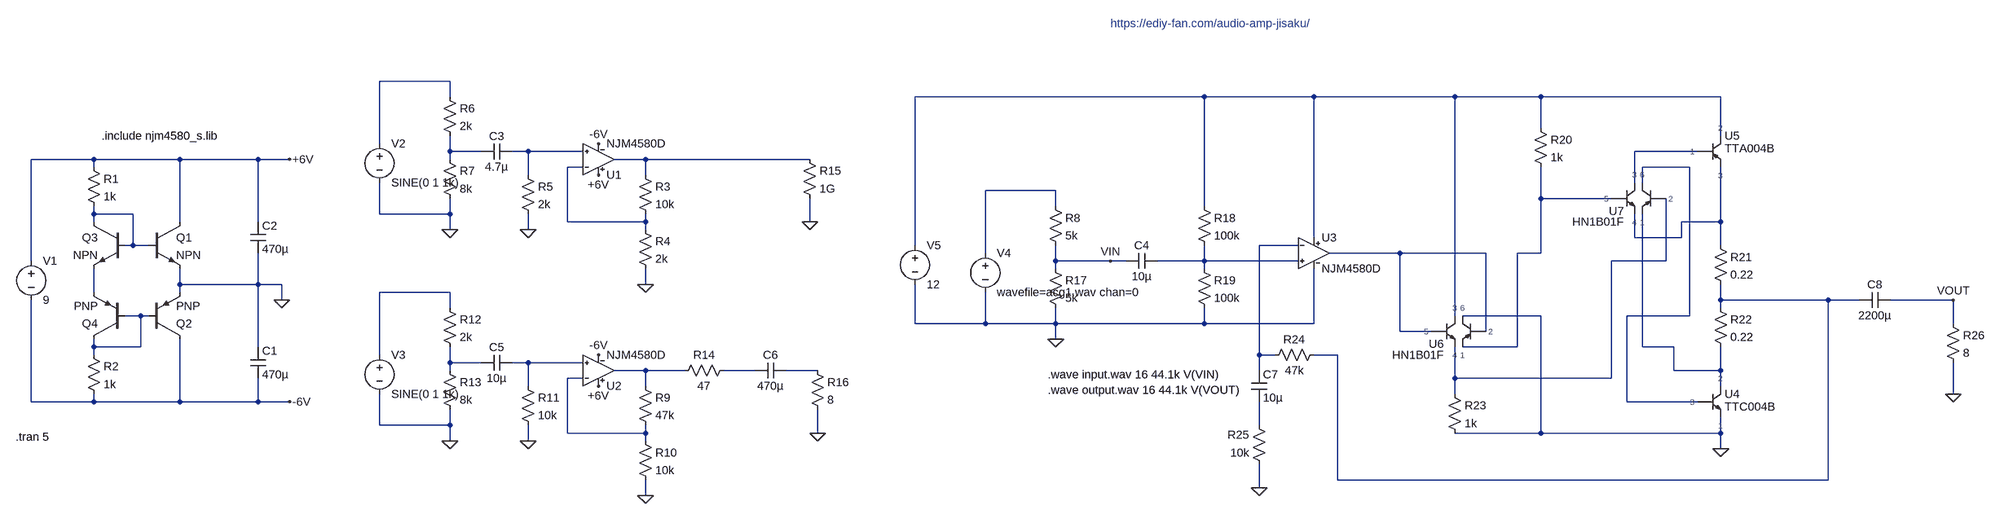
[diagram p0: schematic audio_amplifer.asc]
audio_amplifer.asc, the LTspice schematic file:
Version 4
SHEET 1 5664 680
WIRE 1008 -208 864 -208
WIRE 1008 -176 1008 -208
WIRE 2896 -176 2304 -176
WIRE 3120 -176 2896 -176
WIRE 3408 -176 3120 -176
WIRE 3584 -176 3408 -176
WIRE 3952 -176 3584 -176
WIRE 3584 -112 3584 -176
WIRE 3952 -96 3952 -176
WIRE 864 -80 864 -208
WIRE 1008 -64 1008 -96
WIRE 1072 -64 1008 -64
WIRE 1168 -64 1136 -64
WIRE 1280 -64 1168 -64
WIRE 3904 -64 3776 -64
WIRE 240 -48 112 -48
WIRE 416 -48 240 -48
WIRE 576 -48 416 -48
WIRE 640 -48 576 -48
WIRE 1008 -48 1008 -64
WIRE 1408 -48 1344 -48
WIRE 1744 -48 1408 -48
WIRE 240 -32 240 -48
WIRE 1280 -32 1248 -32
WIRE 3888 -32 3792 -32
WIRE 1168 -16 1168 -64
WIRE 1408 -16 1408 -48
WIRE 3776 0 3776 -64
WIRE 3792 0 3792 -32
WIRE 2592 16 2448 16
WIRE 3584 32 3584 -32
WIRE 3728 32 3584 32
WIRE 2592 48 2592 16
WIRE 2896 48 2896 -176
WIRE 240 64 240 48
WIRE 320 64 240 64
WIRE 864 64 864 0
WIRE 1008 64 1008 32
WIRE 1008 64 864 64
WIRE 240 80 240 64
WIRE 416 80 416 -48
WIRE 576 80 576 -48
WIRE 1248 80 1248 -32
WIRE 1408 80 1408 64
WIRE 1408 80 1248 80
WIRE 1744 80 1744 32
WIRE 3952 80 3952 -32
WIRE 3952 80 3872 80
WIRE 1008 96 1008 64
WIRE 1168 96 1168 64
WIRE 1408 96 1408 80
WIRE 3120 112 3120 -176
WIRE 3776 112 3776 64
WIRE 3872 112 3872 80
WIRE 3872 112 3776 112
WIRE 320 128 320 64
WIRE 320 128 304 128
WIRE 352 128 320 128
WIRE 2304 128 2304 -176
WIRE 3088 128 3008 128
WIRE 3952 128 3952 80
WIRE 2448 144 2448 16
WIRE 3296 144 3152 144
WIRE 3472 144 3296 144
WIRE 3584 144 3584 32
WIRE 3584 144 3536 144
WIRE 112 160 112 -48
WIRE 2592 160 2592 128
WIRE 2704 160 2592 160
WIRE 2736 160 2704 160
WIRE 2896 160 2896 128
WIRE 2896 160 2800 160
WIRE 3088 160 2896 160
WIRE 3840 160 3840 32
WIRE 3840 160 3728 160
WIRE 2592 176 2592 160
WIRE 2896 176 2896 160
WIRE 416 208 416 176
WIRE 576 208 576 144
WIRE 576 208 416 208
WIRE 624 208 576 208
WIRE 1408 208 1408 176
WIRE 240 224 240 176
WIRE 416 224 416 208
WIRE 1008 224 864 224
WIRE 624 240 624 208
WIRE 3952 240 3952 208
WIRE 4208 240 3952 240
WIRE 4272 240 4208 240
WIRE 4464 240 4336 240
WIRE 1008 256 1008 224
WIRE 3952 256 3952 240
WIRE 336 272 304 272
WIRE 352 272 336 272
WIRE 3408 272 3408 -176
WIRE 3584 272 3424 272
WIRE 3888 272 3888 -32
WIRE 3888 272 3760 272
WIRE 2304 288 2304 208
WIRE 2448 288 2448 224
WIRE 2448 288 2304 288
WIRE 2592 288 2592 256
WIRE 2592 288 2448 288
WIRE 2896 288 2896 256
WIRE 2896 288 2592 288
WIRE 3120 288 3120 176
WIRE 3120 288 2896 288
WIRE 4464 288 4464 240
WIRE 3296 304 3296 144
WIRE 3360 304 3296 304
WIRE 3472 304 3472 144
WIRE 2592 320 2592 288
WIRE 240 336 240 320
WIRE 336 336 336 272
WIRE 336 336 240 336
WIRE 576 336 576 208
WIRE 3536 336 3536 144
WIRE 3536 336 3424 336
WIRE 3792 336 3792 64
WIRE 3856 336 3792 336
WIRE 240 352 240 336
WIRE 864 352 864 224
WIRE 3008 352 3008 128
WIRE 3040 352 3008 352
WIRE 3168 352 3120 352
WIRE 1008 368 1008 336
WIRE 1072 368 1008 368
WIRE 1168 368 1136 368
WIRE 1280 368 1168 368
WIRE 1008 384 1008 368
WIRE 1408 384 1344 384
WIRE 1488 384 1408 384
WIRE 1632 384 1568 384
WIRE 1760 384 1696 384
WIRE 3008 384 3008 352
WIRE 3856 384 3856 336
WIRE 3952 384 3952 336
WIRE 3952 384 3856 384
WIRE 1280 400 1248 400
WIRE 3408 400 3408 336
WIRE 3728 400 3728 160
WIRE 3728 400 3408 400
WIRE 1168 416 1168 368
WIRE 1408 416 1408 384
WIRE 3952 416 3952 384
WIRE 3408 432 3408 400
WIRE 4464 432 4464 368
WIRE 112 448 112 240
WIRE 240 448 240 432
WIRE 240 448 112 448
WIRE 416 448 416 320
WIRE 416 448 240 448
WIRE 576 448 576 400
WIRE 576 448 416 448
WIRE 640 448 576 448
WIRE 3760 448 3760 272
WIRE 3904 448 3760 448
WIRE 864 496 864 432
WIRE 1008 496 1008 464
WIRE 1008 496 864 496
WIRE 3008 496 3008 448
WIRE 1248 512 1248 400
WIRE 1408 512 1408 496
WIRE 1408 512 1248 512
WIRE 1760 512 1760 464
WIRE 3584 512 3584 272
WIRE 3584 512 3408 512
WIRE 3952 512 3952 480
WIRE 3952 512 3584 512
WIRE 1008 528 1008 496
WIRE 1168 528 1168 496
WIRE 1408 528 1408 512
WIRE 3952 544 3952 512
WIRE 3168 608 3168 352
WIRE 4208 608 4208 240
WIRE 4208 608 3168 608
WIRE 3008 624 3008 576
WIRE 1408 640 1408 608
FLAG 624 240 0
FLAG 640 -48 +6V
FLAG 640 448 -6V
FLAG 1312 -80 -6V
FLAG 1408 208 0
FLAG 1168 96 0
FLAG 1008 96 0
FLAG 1312 352 -6V
FLAG 1312 416 +6V
FLAG 1408 640 0
FLAG 1168 528 0
FLAG 1008 528 0
FLAG 1744 80 0
FLAG 1760 512 0
FLAG 2592 320 0
FLAG 1312 -16 +6V
FLAG 3952 544 0
FLAG 3008 624 0
FLAG 4464 432 0
FLAG 2704 160 VIN
FLAG 4464 240 VOUT
SYMBOL voltage 112 144 R0
WINDOW 123 0 0 Left 0
WINDOW 39 24 124 Left 2
SYMATTR InstName V1
SYMATTR Value 9
SYMBOL NJM4580DD 1312 16 M180
SYMATTR InstName U1
SYMBOL npn 352 80 R0
SYMATTR InstName Q1
SYMBOL npn 304 80 M0
SYMATTR InstName Q3
SYMBOL pnp 304 320 R180
SYMATTR InstName Q4
SYMBOL res 224 -48 R0
SYMATTR InstName R1
SYMATTR Value 1k
SYMBOL cap 560 336 R0
SYMATTR InstName C1
SYMATTR Value 470µ
SYMBOL cap 560 80 R0
SYMATTR InstName C2
SYMATTR Value 470µ
SYMBOL res 224 336 R0
SYMATTR InstName R2
SYMATTR Value 1k
SYMBOL pnp 352 320 M180
SYMATTR InstName Q2
SYMBOL res 1392 -32 R0
SYMATTR InstName R3
SYMATTR Value 10k
SYMBOL res 1392 80 R0
SYMATTR InstName R4
SYMATTR Value 2k
SYMBOL res 1152 -32 R0
SYMATTR InstName R5
SYMATTR Value 2k
SYMBOL cap 1136 -80 R90
WINDOW 0 0 32 VBottom 2
WINDOW 3 32 32 VTop 2
SYMATTR InstName C3
SYMATTR Value 4.7µ
SYMBOL res 992 -192 R0
SYMATTR InstName R6
SYMATTR Value 2k
SYMBOL res 992 -64 R0
SYMATTR InstName R7
SYMATTR Value 8k
SYMBOL voltage 864 -96 R0
WINDOW 123 0 0 Left 0
WINDOW 39 24 124 Left 2
SYMATTR InstName V2
SYMATTR Value SINE(0 1 1k)
SYMBOL NJM4580DD 1312 448 M180
SYMATTR InstName U2
SYMBOL res 1392 400 R0
SYMATTR InstName R9
SYMATTR Value 47k
SYMBOL res 1392 512 R0
SYMATTR InstName R10
SYMATTR Value 10k
SYMBOL res 1152 400 R0
SYMATTR InstName R11
SYMATTR Value 10k
SYMBOL cap 1136 352 R90
WINDOW 0 0 32 VBottom 2
WINDOW 3 32 32 VTop 2
SYMATTR InstName C5
SYMATTR Value 10µ
SYMBOL res 992 240 R0
SYMATTR InstName R12
SYMATTR Value 2k
SYMBOL res 992 368 R0
SYMATTR InstName R13
SYMATTR Value 8k
SYMBOL res 1584 368 R90
WINDOW 0 0 56 VBottom 2
WINDOW 3 32 56 VTop 2
SYMATTR InstName R14
SYMATTR Value 47
SYMBOL cap 1696 368 R90
WINDOW 0 0 32 VBottom 2
WINDOW 3 32 32 VTop 2
SYMATTR InstName C6
SYMATTR Value 470µ
SYMBOL voltage 864 336 R0
WINDOW 123 0 0 Left 0
WINDOW 39 24 124 Left 2
SYMATTR InstName V3
SYMATTR Value SINE(0 1 1k)
SYMBOL res 1728 -64 R0
SYMATTR InstName R15
SYMATTR Value 1G
SYMBOL res 1744 368 R0
SYMATTR InstName R16
SYMATTR Value 8
SYMBOL voltage 2448 128 R0
WINDOW 123 0 0 Left 0
WINDOW 39 24 124 Left 2
SYMATTR InstName V4
SYMATTR Value wavefile=acg1.wav chan=0
SYMBOL res 2576 32 R0
SYMATTR InstName R8
SYMATTR Value 5k
SYMBOL res 2576 160 R0
SYMATTR InstName R17
SYMATTR Value 5k
SYMBOL cap 2800 144 R90
WINDOW 0 0 32 VBottom 2
WINDOW 3 32 32 VTop 2
SYMATTR InstName C4
SYMATTR Value 10µ
SYMBOL res 2880 32 R0
SYMATTR InstName R18
SYMATTR Value 100k
SYMBOL res 2880 160 R0
SYMATTR InstName R19
SYMATTR Value 100k
SYMBOL res 3568 -128 R0
SYMATTR InstName R20
SYMATTR Value 1k
SYMBOL res 3936 112 R0
SYMATTR InstName R21
SYMATTR Value 0.22
SYMBOL res 3936 240 R0
SYMATTR InstName R22
SYMATTR Value 0.22
SYMBOL res 3392 416 R0
SYMATTR InstName R23
SYMATTR Value 1k
SYMBOL cap 2992 384 R0
SYMATTR InstName C7
SYMATTR Value 10µ
SYMBOL res 3136 336 R90
WINDOW 0 0 56 VBottom 2
WINDOW 3 32 56 VTop 2
SYMATTR InstName R24
SYMATTR Value 47k
SYMBOL res 3024 592 R180
WINDOW 0 36 76 Left 2
WINDOW 3 36 40 Left 2
SYMATTR InstName R25
SYMATTR Value 10k
SYMBOL cap 4336 224 R90
WINDOW 0 0 32 VBottom 2
WINDOW 3 32 32 VTop 2
SYMATTR InstName C8
SYMATTR Value 2200µ
SYMBOL res 4448 272 R0
SYMATTR InstName R26
SYMATTR Value 8
SYMBOL voltage 2304 112 R0
WINDOW 123 24 124 Left 2
WINDOW 39 24 124 Left 2
SYMATTR InstName V5
SYMATTR Value 12
SYMBOL NJM4580DD 3120 80 R0
SYMATTR InstName U3
SYMBOL TTC004B 3920 432 R0
SYMATTR InstName U4
SYMBOL TTA004B 3920 -80 R0
SYMATTR InstName U5
SYMBOL HN1B01F 3456 288 M0
SYMATTR InstName U6
SYMBOL HN1B01F 3824 16 M0
SYMATTR InstName U7
TEXT 256 -96 Left 2 !.include njm4580_s.lib
TEXT 80 520 Left 2 !.tran 5
TEXT 2576 392 Left 2 !.wave input.wav 16 44.1k V(VIN)
TEXT 2576 424 Left 2 !.wave output.wav 16 44.1k V(VOUT)
TEXT 2704 -328 Left 2 ;https://ediy-fan.com/audio-amp-jisaku/

The netlist it stands for:
* audio_amplifer.asc
V1 +6V -6V 9
XU1 N004 N007 +6V -6V N006 AD549  ; pins In+ In- V+ V- OUT
Q1 +6V N011 0 0 NPN
Q3 N011 N011 N017 0 NPN
Q4 N020 N020 N017 0 PNP
R1 +6V N011 1k
C1 0 -6V 470µ
C2 +6V 0 470µ
R2 N020 -6V 1k
Q2 -6V N020 0 0 PNP
R3 N006 N007 10k
R4 N007 0 2k
R5 N004 0 2k
C3 N004 N003 4.7µ
R6 N001 N003 2k
R7 N003 0 8k
V2 N001 0 SINE(0 1 1k)
XU2 N023 N027 +6V -6V N024 AD549  ; pins In+ In- V+ V- OUT
R9 N024 N027 47k
R10 N027 0 10k
R11 N023 0 10k
C5 N023 N022 10µ
R12 N018 N022 2k
R13 N022 0 8k
R14 N025 N024 47
C6 N026 N025 470µ
V3 N018 0 SINE(0 1 1k)
R15 N006 0 1G
R16 N026 0 8
V4 N009 0 wavefile=acg1.wav chan=0
R8 N009 VIN 5k
R17 VIN 0 5k
C4 N015 VIN 10µ
R18 N002 N015 100k
R19 N015 0 100k
R20 N002 N010 1k
R21 N012 N019 0.22
R22 N019 N021 0.22
R23 N016 0 1k
C7 N013 N028 10µ
R24 N019 N013 47k
R25 0 N028 10k
C8 VOUT N019 2200µ
R26 VOUT 0 8
V5 N002 0 12
XU3 N015 N013 N002 0 N014 AD549  ; pins In+ In- V+ V- OUT
XU4 N021 N008 0 TTC004B  ; pins 2 3 1
XU5 N002 N005 N012 TTA004B  ; pins 2 1 3
XU6 0 N014 N010 N002 N014 N016 HN1B01F  ; pins 6 2 1 3 5 4
XU7 N008 N016 N021 N005 N010 N012 HN1B01F  ; pins 6 2 1 3 5 4
.model NPN NPN
.model PNP PNP
.lib standard.bjt
.include njm4580_s.lib
.tran 5
.wave input.wav 16 44.1k V(VIN)
.wave output.wav 16 44.1k V(VOUT)
* https://ediy-fan.com/audio-amp-jisaku/
.lib ADI1.lib
.lib TTC004B.mod
.lib TTA004B.mod
.lib HN1B01F.mod
.backanno
.end